# EAGLE design leslius (EAGLE 8.5.1)
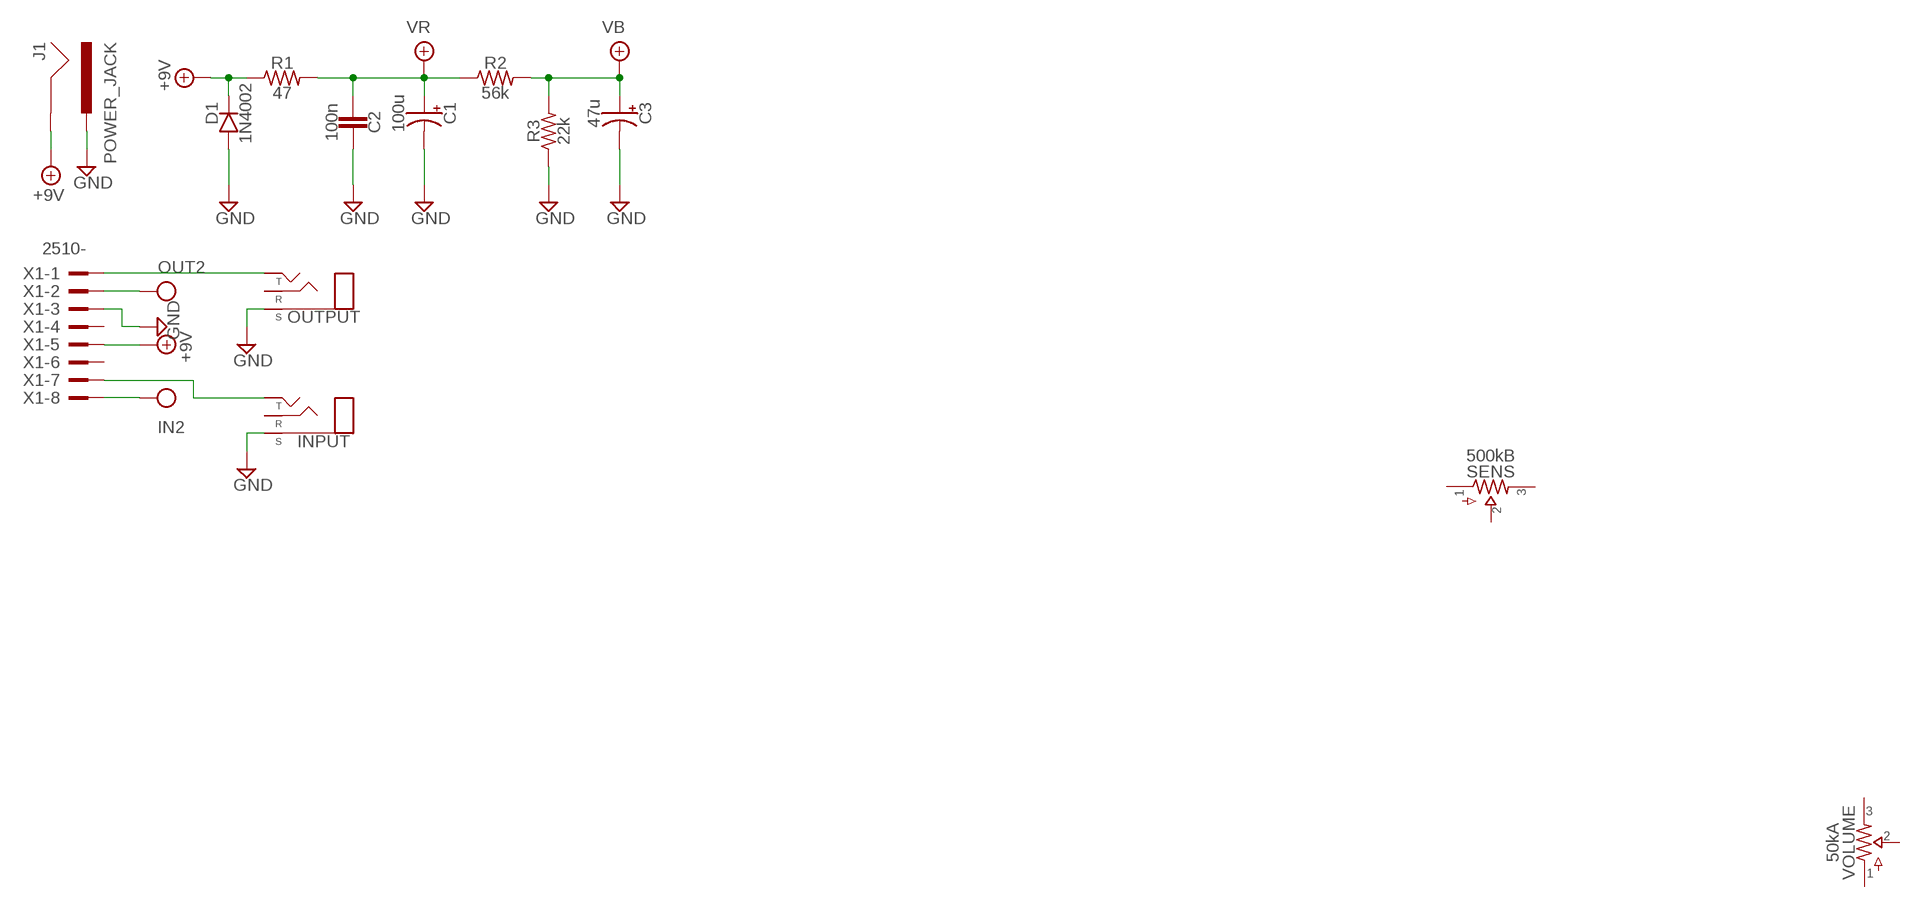
[diagram p0: schematic, sheet 1]

## Parts
C1  100u  0400  [040_020]
C2  100n  CER/FILM2  [050X030_025_2]
C3  47u  0400  [040_020]
D1  1N4002  DO41.2  [DO41-2]
INPUT  STEREONMJ  [NMJ6HCD2]
J1  POWER_JACK  [POWER_JACK_PTH]
OUTPUT  STEREONMJ  [NMJ6HCD2]
R1  47  R_.3B  [R0207/3]
R2  56k  R_.3B  [R0207/3]
R3  22k  R_.3B  [R0207/3]
SENS  500kB  POTS16MM  [16MM]
VOLUME  50kA  POTS16MM  [16MM]
X1  2510-  [PAK100/2500-10]

## Nets
+9V: D1.C J1.GND R1.1 X1.5
GND: C1.- C2.1 C3.- D1.A INPUT.S J1.PWR OUTPUT.S R3.1 X1.3
IN: X1.8
N$2: INPUT.T X1.7
N$4: OUTPUT.T X1.1
OUT: X1.2
VB: C3.+ R2.2 R3.2
VR: C1.+ C2.2 R1.2 R2.1
Unconnected: INPUT.R OUTPUT.R SENS.1 SENS.2 SENS.3 VOLUME.1 VOLUME.2 VOLUME.3 X1.4 X1.6

## Library data of the parts
C1 C3 = pedals-capacitors-elec:040
C2 = pedals-capacitors-film:CER/FILM: 47 - 120pF Xicon Ceramic Disc 2.5mm lead spacing
D1 = pedals-diodes:DO41: DO-41 Package Diodes: 1N4001 - 1N40019 Zener Diodes: 1N4728 - 1N4764
INPUT OUTPUT = pedals-jacks:STEREO
J1 = pedals-jacks:POWER_JACK: Power Jack Connector This is the standard 5.5mm barrel jack for power. The PTH is the most common, proven, reliable, footprint. The Slot footprint only works if the mill layer is transmitted to the PCB fab house so be warned. Here are the connectors we sell at SparkFun: DC Barrel Power Jack/Connector <https://www.sparkfun.com/products/119> (PRT-00119) DC Barrel Power Jack/Connector (SMD) <https://www.sparkfun.com/products/12748> (PRT-12748) DC Barrel Jack Adapter - Breadboard Compatible <https://www.sparkfun.com/products/10811> (PRT-10811) It is used on this SparkFun product (and many, many others): SparkFun RedBoard - Programmed with Arduino <https://www.sparkfun.com/products/12757> (DEV-12757) Also, if you need a mating power supply or connector, please check these out: Wall Adapter Power Supply - 9VDC 650mA <https://www.sparkfun.com/products/298> (TOL-00298) DC Barrel Jack Adapter - Male <https://www.sparkfun.com/products/10287> (PRT-10287); PROD_ID: CONN-08197
R1-R3 = pedals-resistors:R_
SENS VOLUME = pedals-potentiometers:POTS
X1 = pedals-headers:2510-: 3M (TM) Pak 100 4-Wall Header Source: 3M; MF: 3M; MPN: 2510-6002UB; OC_FARNELL: 9838244; OC_NEWARK: 46F4725

## Board
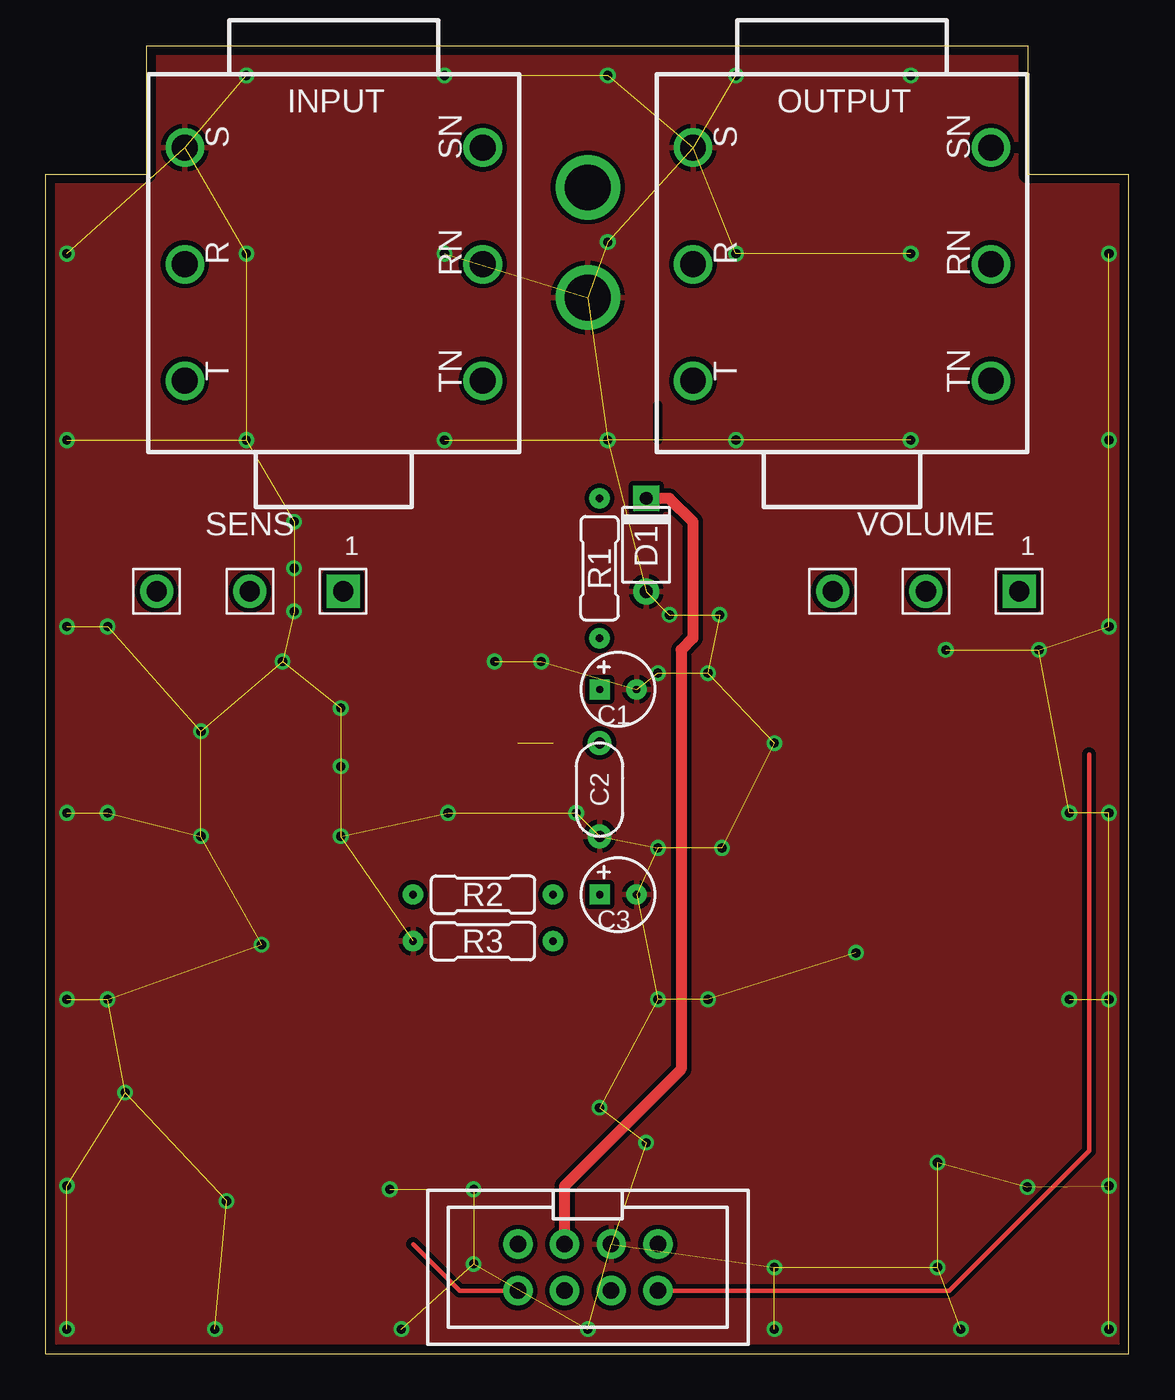
[diagram p1: board, top side]
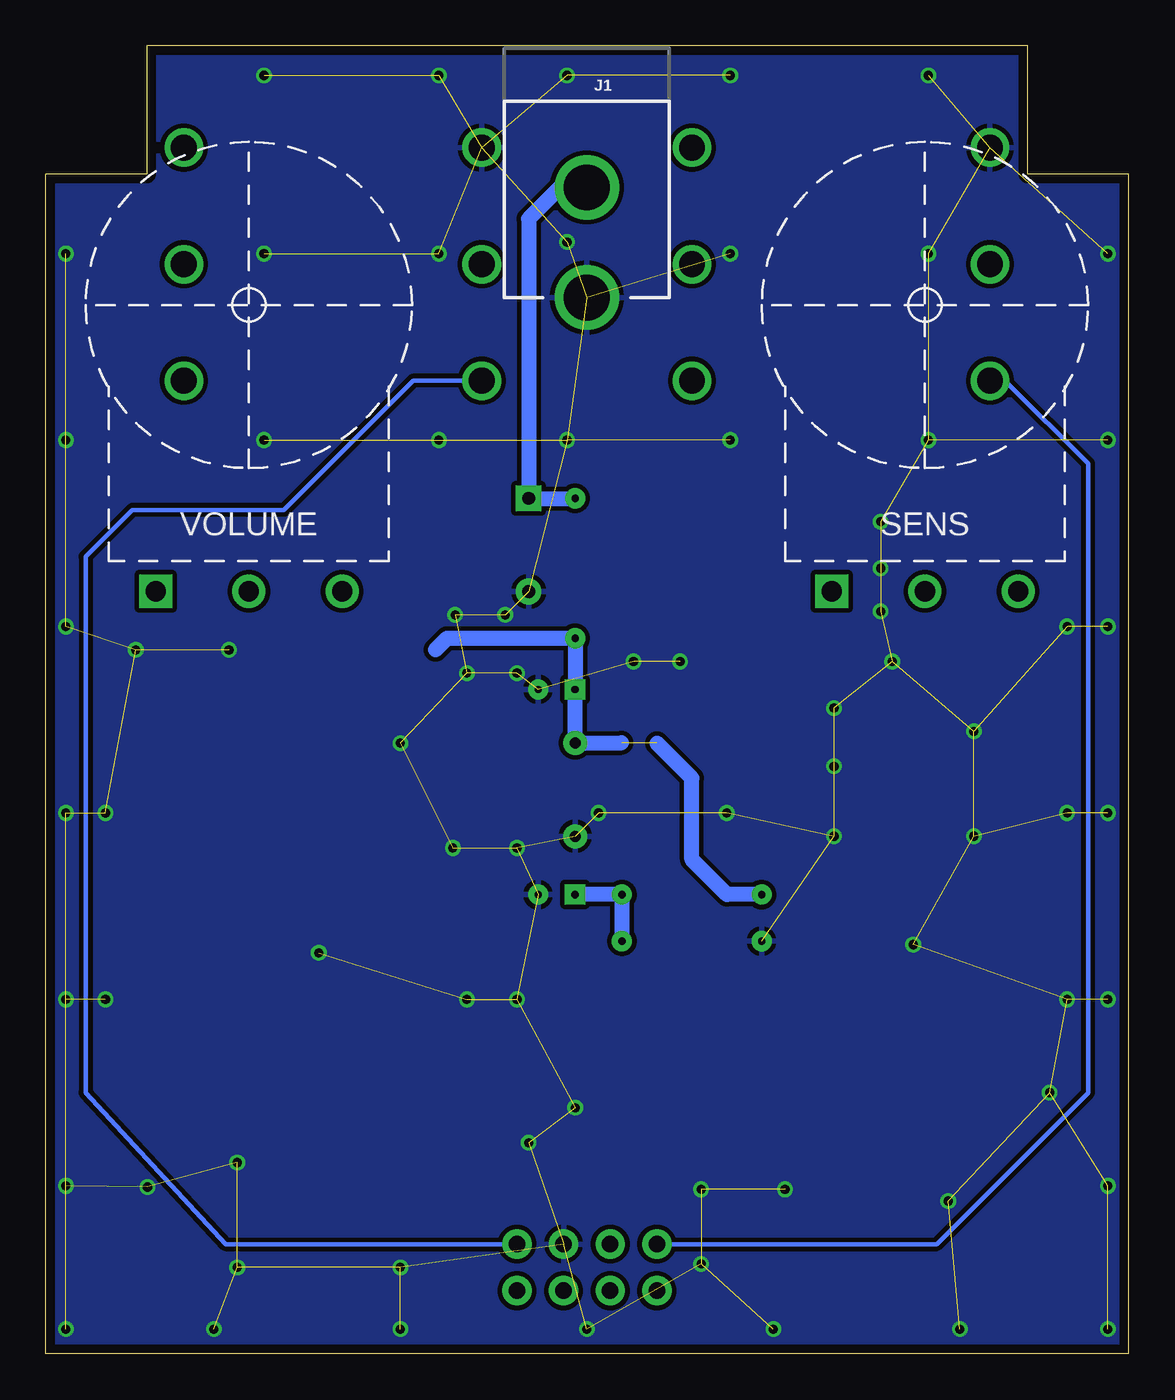
[diagram p2: board, bottom side, seen from below]

Size 59 x 71.27 mm. Coordinates in mm from the lower left corner, seen from the top.
Copper layers (1*16): Top 0.035mm / dielectric 1.6mm / Bottom 0.035mm
Design rules "Elecrow_2-layer_PCB_eagle_rule": minimum track width 6mil, minimum drill 12mil, track to track 6mil, track to pad 6mil, pad to pad 6mil, via to via 8mil, smd to smd 0mil, copper to edge 20mil, drill to drill 10mil, minimum pad ring 6mil, minimum via ring 6mil, stop-mask expansion 0mil, vias tented up to drill 100mil, thermal gap 10mil
tRestrict: 1 lines

### Footprints (pad centres in the part's own frame; a part is rotated, then mirrored left to right if it is on the bottom)
040_020 = drill 0.4 pad 1.1 square: + -1.001,0 | drill 0.4 pad 1.1: - 1.001,0
050X030_025_2 = drill 0.6 pad 1.3: 1 -2.54,0; 2 2.54,0
DO41-2 = drill 0.7 pad 1.4: A 2.54,0 | drill 0.7 pad 1.4 square: C -2.54,0
NMJ6HCD2 = drill 1.4: R 0,8.115; RN 0,-8.115; S 6.35,8.115; SN 6.35,-8.115; T -6.35,8.115; TN -6.35,-8.115
POWER_JACK_PTH = drill 2.5: GND 0,7.7; PWR 0,13.7
R0207/3 = drill 0.4 pad 1.1: 1 -3.81,0; 2 3.81,0
16MM = drill 1.1 pad 1.8 square: 1 5.08,-1 | drill 1.1 pad 1.8: 2 0,-1; 3 -5.08,-1
PAK100/2500-10 = drill 0.9 pad 1.6: 1 -3.81,-1.27; 2 -3.81,1.27; 3 -1.27,-1.27; 4 -1.27,1.27; 5 1.27,-1.27; 6 1.27,1.27; 7 3.81,-1.27; 8 3.81,1.27

### Placement (x,y rotation side)
C1  31.18,36.19 0 top
C2  30.16,30.73 90 top
C3  31.18,25.02 0 top
D1  32.7,44.07 270 top
INPUT  15.68,59.37 90 top
J1  29.53,71.25 180 bottom
OUTPUT  43.37,59.37 90 top
R1  30.16,42.8 270 top
R2  23.81,25.02 0 top
R3  23.81,22.48 0 top
SENS  11.11,42.55 0 top
U$1  [125B_PCB]  0,1.27 0 top
VOLUME  47.94,42.55 0 top
X1  29.53,4.7 180 top

### Tracks (layer width: path | path; a pad name or v marks a point on that pad's centre or on a via)
+9V
  Top 0.61: X1.5 28.26,9.14 34.61,15.49 34.61,38.35 35.24,38.99 35.24,45.34 33.97,46.61 D1.C
  Bottom 0.813: J1.GND 31,63.55 32.7,61.85 D1.C R1.1
GND  (via drill 0.5 pad 0.85)  (84 unrouted)
  other vias: 57.91,59.94 57.91,49.78 10.92,69.66 21.72,69.66 30.61,69.66 1.14,49.78 10.92,59.94 10.92,49.78 21.72,59.94 21.72,49.78 30.61,60.58 37.59,69.66 47.12,69.66 37.59,59.94 37.59,49.78 47.12,59.94 47.12,49.78 57.91,39.62 57.91,29.46 57.91,19.3 57.91,9.14 57.91,1.33 49.85,1.33 39.69,1.33 29.53,1.33 19.37,1.33 9.21,1.33 1.14,1.33 1.14,59.94 1.14,39.62 1.14,29.46 1.14,19.3 1.14,9.14 30.61,49.78 54.1,38.35 55.75,29.46 55.75,19.3 36.07,19.3 33.34,19.3 36.83,27.56 33.34,27.56 23.3,4.89 23.3,8.95 39.69,4.7 48.58,4.7 53.47,9.08 18.73,8.95 9.84,8.32 4.32,14.22 3.37,19.3 3.37,29.46 3.37,39.62 36.07,37.08 33.34,37.08 36.7,40.26 33.97,40.26 49.02,38.35 16.07,28.19 16.07,32 16.07,35.18 12.89,37.72 13.53,40.45 13.53,42.8 13.53,45.34 28.89,29.46 21.91,29.46 8.45,28.19 8.45,33.91 32.7,11.49 30.16,13.4 26.99,37.72 24.45,37.72 48.58,10.41 44.13,21.84 39.69,33.27 11.75,22.29
  pour Bottom (isolate 0.254): 0.32,70.74 58.74,70.74 58.74,-1.02 0.32,-1.02
  pour Top (isolate 0.254): 59.37,0.25 59.37,71.37 -0.32,71.37 -0.32,-0.38 59.37,-0.38
IN
  Top 0.254: X1.8 22.54,3.43 20,5.97
N$2
  Bottom 0.254: X1.7 10.48,5.97 2.22,14.22 2.22,48.51 6.67,52.96 7.51,52.96 INPUT.T
N$4
  Bottom 0.254: OUTPUT.T 38.99,53.02 46.04,45.97 54.29,45.97 56.83,43.43 56.83,14.22 49.21,5.97 X1.1
OUT
  Top 0.254: X1.2 49.21,3.43 56.83,11.05 56.83,32.66
VB
  Bottom 0.813: R3.2 R2.2 C3.+
VR  (1 unrouted)
  Bottom 0.813: 30.18,33.29 C1.+ 30.16,36.21 R1.2 37.15,38.99 37.78,38.35 | 30.18,33.29 C2.2 | 30.18,33.29 27.64,33.29 | R2.1 21.91,25.02 23.81,26.92 23.81,31.37 25.72,33.27